# Altium schematic sheet Revision History.SchDoc: Revision History
size 431 x 279 mm; DrawnBy: DD; DocumentNumber: GHL-1-21002; Revision: A; SheetNumber: 7; SheetTotal: 7; ProjectID: 263-03
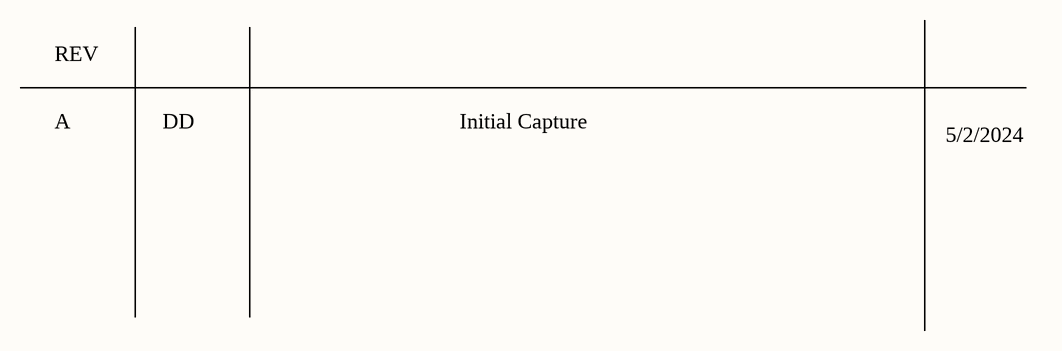
[diagram p0: Revision History.SchDoc]

## Notes on the sheet
- REV
- A
- DD
- Initial Capture
- 5/2/2024
- REVISION
- DESCRIPTION
- DATE
- APPROVED
- 295 Foster St
- PROJECT
- www.odic.com <http://www.odic.com>
- Littleton, MA
- 01460
- Suite 202
- TITLE
- DRAWN:
- CHECKED:
- APPROVALS
- SIZE
- B
- PROJECT ID
- DWG NO.
- SHEET
- OF
- APPROVED:
- FILE NAME